# EAGLE design radical-master (EAGLE 7.2.0)
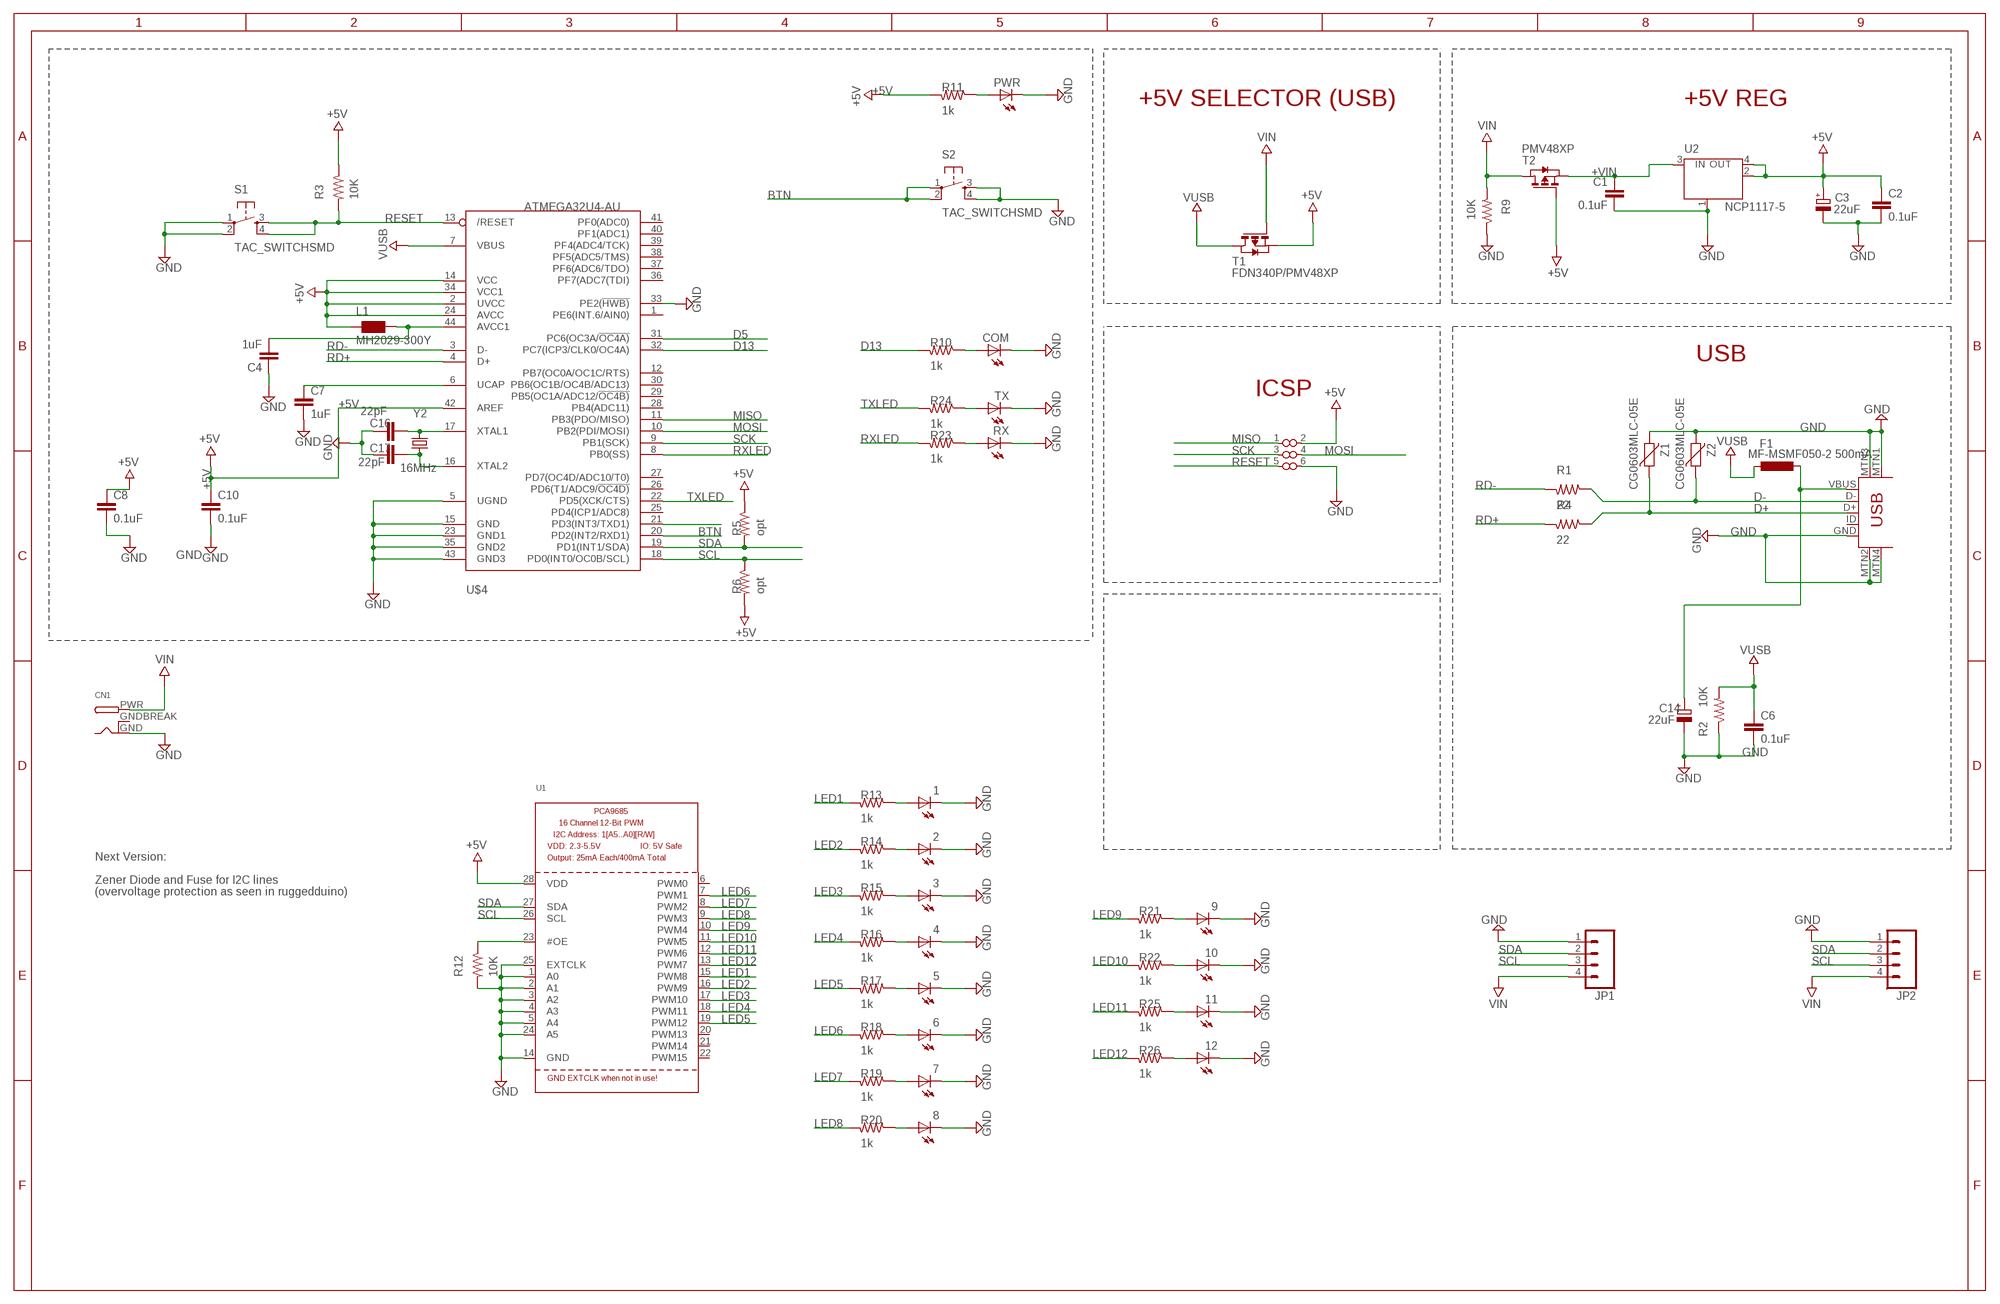
[diagram p0: schematic, sheet 1]

## Parts
1  LEDCHIPLED_0603  [CHIPLED_0603]
2  LEDCHIPLED_0603  [CHIPLED_0603]
3  LEDCHIPLED_0603  [CHIPLED_0603]
4  LEDCHIPLED_0603  [CHIPLED_0603]
5  LEDCHIPLED_0603  [CHIPLED_0603]
6  LEDCHIPLED_0603  [CHIPLED_0603]
7  LEDCHIPLED_0603  [CHIPLED_0603]
8  LEDCHIPLED_0603  [CHIPLED_0603]
9  LEDCHIPLED_0603  [CHIPLED_0603]
10  LEDCHIPLED_0603  [CHIPLED_0603]
11  LEDCHIPLED_0603  [CHIPLED_0603]
12  LEDCHIPLED_0603  [CHIPLED_0603]
C1  0.1uF  CAP0603-CAP  [0603-CAP]
C2  0.1uF  CAP0603-CAP  [0603-CAP]
C3  22uF  CPOL-EUSMCB  [SMC_B]
C4  1uF  CAP0603-CAP  [0603-CAP]
C6  0.1uF  CAP0603-CAP  [0603-CAP]
C7  1uF  CAP0603-CAP  [0603-CAP]
C8  0.1uF  CAP0603-CAP  [0603-CAP]
C10  0.1uF  CAP0603-CAP  [0603-CAP]
C14  22uF  CPOL-EUSMCB  [SMC_B]
C16  22pF  CAP0603-CAP  [0603-CAP]
C17  22pF  CAP0603-CAP  [0603-CAP]
CN1  DCBARRELPTH  [DCJACK_2MM_PTH]
COM  LEDCHIPLED_0603  [CHIPLED_0603]
F1  MF-MSMF050-2 500mA  L-EUL1812  [L1812]
JP1  M04PTH  [1X04]
JP2  M04PTH  [1X04]
L1  MH2029-300Y  WE-CBF_0805  [0805]
PWR  LEDCHIPLED_0603  [CHIPLED_0603]
R1  22  RESISTOR0805-RES  [0805]
R2  10K  RESISTOR0805-RES  [0805]
R3  10K  RESISTOR0805-RES  [0805]
R4  22  RESISTOR0805-RES  [0805]
R5  opt  RESISTOR0805-RES  [0805]
R6  opt  RESISTOR0805-RES  [0805]
R9  10K  RESISTOR0805-RES  [0805]
R10  1k  RESISTOR0805-RES  [0805]
R11  1k  RESISTOR0805-RES  [0805]
R12  10K  RESISTOR0805-RES  [0805]
R13  1k  RESISTOR0805-RES  [0805]
R14  1k  RESISTOR0805-RES  [0805]
R15  1k  RESISTOR0805-RES  [0805]
R16  1k  RESISTOR0805-RES  [0805]
R17  1k  RESISTOR0805-RES  [0805]
R18  1k  RESISTOR0805-RES  [0805]
R19  1k  RESISTOR0805-RES  [0805]
R20  1k  RESISTOR0805-RES  [0805]
R21  1k  RESISTOR0805-RES  [0805]
R22  1k  RESISTOR0805-RES  [0805]
R23  1k  RESISTOR0805-RES  [0805]
R24  1k  RESISTOR0805-RES  [0805]
R25  1k  RESISTOR0805-RES  [0805]
R26  1k  RESISTOR0805-RES  [0805]
RX  LEDCHIPLED_0603  [CHIPLED_0603]
S1  TAC_SWITCHSMD  [TACTILE-SWITCH-SMD]
S2  TAC_SWITCHSMD  [TACTILE-SWITCH-SMD]
T1  FDN340P/PMV48XP  PMOSSOT23  [SOT-23]
T2  PMV48XP  PMOSSOT23  [SOT-23]
TX  LEDCHIPLED_0603  [CHIPLED_0603]
U1  PCA9685  [TSSOP28]
U2  NCP1117-5  LINEAR_MC33269ST  [LINEAR_SOT223]
U$3  USB-MINIB-5PIN  [USB-MINIB]
U$4  ATMEGA32U4-AU  [TQFP44]
U$10  ISP_POGO  [POGO_ISP]
Y2  16MHz  CRYSTAL5X3  [CRYSTAL-SMD-5X3]
Z1  CG0603MLC-05E  VARISTORCN0603  [CT/CN0603]
Z2  CG0603MLC-05E  VARISTORCN0603  [CT/CN0603]

## Nets
+5V: C2.1 C3.+ C8.1 C10.1 L1.1 R3.1 R5.1 R6.2 R11.2 T1.2(S) T2.3(G) U1.28(VDD) U2.2(OUT) U2.4(OUT) U$4.2(UVCC) U$4.14(VCC) U$4.24(AVCC) U$4.34(VCC1) U$4.42(AREF) U$10.2(VCC)
+VIN: C1.1 T2.2(S) U2.3(IN)
BTN: S2.1 S2.2 U$4.20(PD2(INT2/RXD1))
D5: U$4.31(PC6(OC3A/!OC4A))
D13: R10.2 U$4.32(PC7(ICP3/CLK0/OC4A))
D+: R4.1 U$3.D+ Z1.1
D-: R1.1 U$3.D- Z2.1
GND: 1.C 2.C 3.C 4.C 5.C 6.C 7.C 8.C 9.C 10.C 11.C 12.C C1.2 C2.2 C3.- C4.1 C6.2 C7.2 C8.2 C10.2 C14.- C16.2 C17.2 CN1.GND COM.C JP1.1 JP2.1 PWR.C R2.1 R9.1 R12.2 RX.C S1.1 S1.2 S2.3 S2.4 TX.C U1.1(A0) U1.2(A1) U1.3(A2) U1.4(A3) U1.5(A4) U1.14(GND) U1.24(A5) U1.25(EXTCLK) U2.1(GND/ADJ) U$3.GND U$3.MTN1(MTN2) U$3.MTN2(MTN3) U$3.MTN3(MTN1) U$3.MTN4 U$4.5(UGND) U$4.15(GND) U$4.23(GND1) U$4.33(PE2(!HWB)) U$4.35(GND2) U$4.43(GND3) U$10.6(GND) Z1.2 Z2.2
LED1: R13.2 U1.15(PWM8)
LED2: R14.2 U1.16(PWM9)
LED3: R15.2 U1.17(PWM10)
LED4: R16.2 U1.18(PWM11)
LED5: R17.2 U1.19(PWM12)
LED6: R18.2 U1.7(PWM1)
LED7: R19.2 U1.8(PWM2)
LED8: R20.2 U1.9(PWM3)
LED9: R21.2 U1.10(PWM4)
LED10: R22.2 U1.11(PWM5)
LED11: R25.2 U1.12(PWM6)
LED12: R26.2 U1.13(PWM7)
MISO: U$4.11(PB3(PDO/MISO)) U$10.1(MISO)
MOSI: U$4.10(PB2(PDI/MOSI)) U$10.4(MOSI)
N$1: C16.1 U$4.17(XTAL1) Y2.3
N$2: U$4.21(PD3(INT3/TXD1))
N$3: C17.1 U$4.16(XTAL2) Y2.1
N$5: C7.1 U$4.6(UCAP)
N$6: C4.2 L1.2 U$4.44(AVCC1)
N$7: R23.1 RX.A
N$8: R24.1 TX.A
N$9: COM.A R10.1
N$10: PWR.A R11.1
N$12: R12.1 U1.23(#OE)
N$14: 1.A R13.1
N$15: 2.A R14.1
N$16: 3.A R15.1
N$17: 4.A R16.1
N$18: 5.A R17.1
N$19: 6.A R18.1
N$20: 7.A R19.1
N$21: 8.A R20.1
N$22: 9.A R21.1
N$23: 10.A R22.1
N$24: 11.A R25.1
N$25: 12.A R26.1
RD+: R4.2 U$4.4(D+)
RD-: R1.2 U$4.3(D-)
RESET: R3.2 S1.3 S1.4 U$4.13(/RESET) U$10.5(RESET)
RXLED: R23.2 U$4.8(PB0(SS))
SCK: U$4.9(PB1(SCK)) U$10.3(SCK)
SCL: JP1.3 JP2.3 R6.1 U1.26(SCL) U$4.18(PD0(INT0/OC0B/SCL))
SDA: JP1.2 JP2.2 R5.2 U1.27(SDA) U$4.19(PD1(INT1/SDA))
TXLED: R24.2 U$4.22(PD5(XCK/CTS))
VIN: CN1.PWR JP1.4 JP2.4 R9.2 T1.3(G) T2.1(D)
VUSB: C6.1 F1.2 R2.2 T1.1(D) U$4.7(VBUS)
VUSBD: C14.+ F1.1 U$3.VBUS
Unconnected: U1.6(PWM0) U1.20(PWM13) U1.21(PWM14) U1.22(PWM15) U$3.ID U$4.1(PE6(INT.6/AIN0)) U$4.12(PB7(OC0A/OC1C/RTS)) U$4.25(PD4(ICP1/ADC8)) U$4.26(PD6(T1/ADC9/!OC4D)) U$4.27(PD7(OC4D/ADC10/T0)) U$4.28(PB4(ADC11)) U$4.29(PB5(OC1A/ADC12/!OC4B)) U$4.30(PB6(OC1B/OC4B/ADC13)) U$4.36(PF7(ADC7(TDI)) U$4.37(PF6(ADC6/TDO)) U$4.38(PF5(ADC5/TMS)) U$4.39(PF4(ADC4/TCK)) U$4.40(PF1(ADC1)) U$4.41(PF0(ADC0))

## Notes on the sheet
- +5V SELECTOR (USB) | +5V REG
- USB
- ICSP
- Next Version:
- Zener Diode and Fuse for I2C lines
- (overvoltage protection as seen in ruggedduino)

## Power pins joined to a net without a drawn wire
GNDBREAK: CN1.GNDBREAK

## Library data of the parts
1-12 COM PWR RX TX = adafruit:LED: LED OSRAM: - CHIPLED LG R971, LG N971, LY N971, LG Q971, LY Q971, LO R971, LY R971 LH N974, LH R974 LS Q976, LO Q976, LY Q976 LO Q996 - Hyper CHIPLED LW Q18S LB Q993, LB Q99A, LB R99A - SideLED LS A670, LO A670, LY A670, LG A670, LP A670 LB A673, LV A673, LT A673, LW A673 LH A674 LY A675 LS A676, LA A676, LO A676, LY A676, LW A676 LS A679, LY A679, LG A679 - Hyper Micro SIDELED® LS Y876, LA Y876, LO Y876, LY Y876 LT Y87S - SmartLED LW L88C, LW L88S LB L89C, LB L89S, LG L890 LS L89K, LO L89K, LY L89K LS L896, LA L896, LO L896, LY L896 - TOPLED LS T670, LO T670, LY T670, LG T670, LP T670 LSG T670, LSP T670, LSY T670, LOP T670, LYG T670 LG T671, LOG T671, LSG T671 LB T673, LV T673, LT T673, LW T673 LH T674 LS T676, LA T676, LO T676, LY T676, LB T676, LH T676, LSB T676, LW T676 LB T67C, LV T67C, LT T67C, LS T67K, LO T67K, LY T67K, LW E67C LS E67B, LA E67B, LO E67B, LY E67B, LB E67C, LV E67C, LT E67C LW T67C LS T679, LY T679, LG T679 LS T770, LO T770, LY T770, LG T770, LP T770 LB T773, LV T773, LT T773, LW T773 LH T774 LS E675, LA E675, LY E675, LS T675 LS T776, LA T776, LO T776, LY T776, LB T776 LHGB T686 LT T68C, LB T68C - Hyper Mini TOPLED® LB M676 - Mini TOPLED Santana® LG M470 LS M47K, LO M47K, LY M47K Source: http://www.osram.convergy.de/
C1 C2 C4 C6-C8 C10 = SparkFun-Capacitors:CAP: Capacitor Standard 0603 ceramic capacitor, and 0.1" leaded capacitor.
C3 C14 = rcl:CPOL-EU: POLARIZED CAPACITOR, European symbol
C16 C17 = SparkFun:CAP: Capacitor Standard 0603 ceramic capacitor, and 0.1" leaded capacitor.
CN1 = adafruit:DCBARREL: 2.0mm DC Barrel Jack DCJACK_2MM_PTH - Through Hole Jack (4UConnector: 05537)
F1 = rcl:L-EU: INDUCTOR, European symbol
JP1 JP2 = SparkFun-Connectors:M04: Header 4 Standard 4-pin 0.1" header. Use with straight break away headers (SKU : PRT-00116), right angle break away headers (PRT-00553), swiss pins (PRT-00743), machine pins (PRT-00117), and female headers (PRT-00115). Molex polarized connector foot print use with SKU : PRT-08231 with associated crimp pins and housings. 1MM SMD Version SKU: PRT-10208
L1 = wuerth-elektronik:WE-CBF: SMD EMI Suppression Ferrite Beads - excellent anti-EMI properties - low DCR - impedances till 3000 ohms - rated current up to 6 A
R1-R6 R9-R26 = SparkFun-Resistors:RESISTOR: Resistor Basic schematic elements and footprints for 0603, 1206, and PTH resistors.
S1 S2 = SparkFun-Electromechanical:TAC_SWITCH: Momentary Switch Button commonly used for reset or general input. Spark Fun Electronics SKU : COM-00097 SMT- SWCH-08247; PROD_ID: SWCH-08247
T1 T2 = zetex:PMOSSOT23: MOS FET
U1 = adafruit:PCA9685: PCA9685 - 16 Channel 12-Bit I2C PWM Controller 5.0V tolerant 16 channel, 12-bit I2C PWM controller with 25mA per output (max. 400mA total) Digikey: 568-5931-1-ND
U2 = SmartPrj:LINEAR_MC33269ST*: Adjustable Output Low Dropout Voltage Regulator 800 mA Source: http://www.onsemi.com/pub/Collateral/MC33269-D.PDF
U$3 = SparkFun-Connectors:USB-MINIB: Mini-USB "B" connector with 5th pin broken out. Created new symbol breaking out 5th "ID" pin in mini/micro USB connector spec. See: http://en.wikipedia.org/wiki/Mini_usb#Cables. Uses same footprint as 4-pin symbol. Also added pins to connect to mounting / shield pads if required (probably not generally needed as signals aren't shielded once they leave the connector).
U$4 = adafruit:ATMEGA32U4: http://www.ladyada.net/library/eagle
U$10 = digikey:ISP_POGO
Y2 = SparkFun:CRYSTAL: Crystals Various standard crystals. Proven footprints. Spark Fun Electronics SKU : COM-00534
Z1 Z2 = varistor:VARISTOR: VARISTOR

## Board
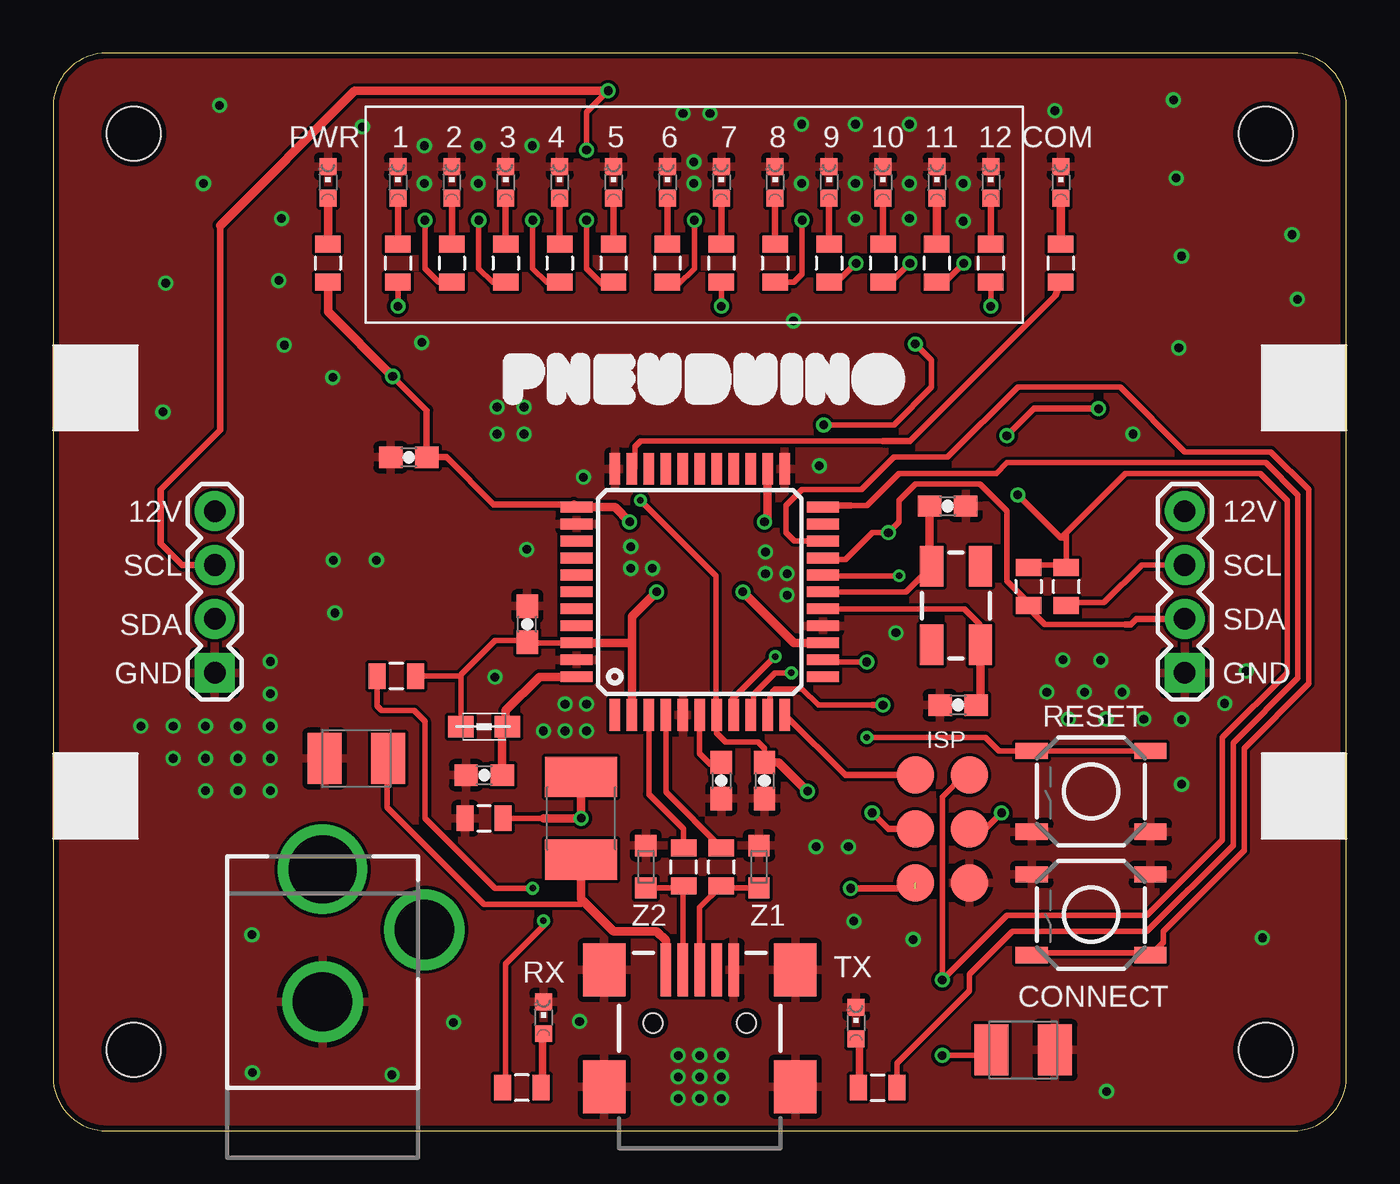
[diagram p1: board, top side]
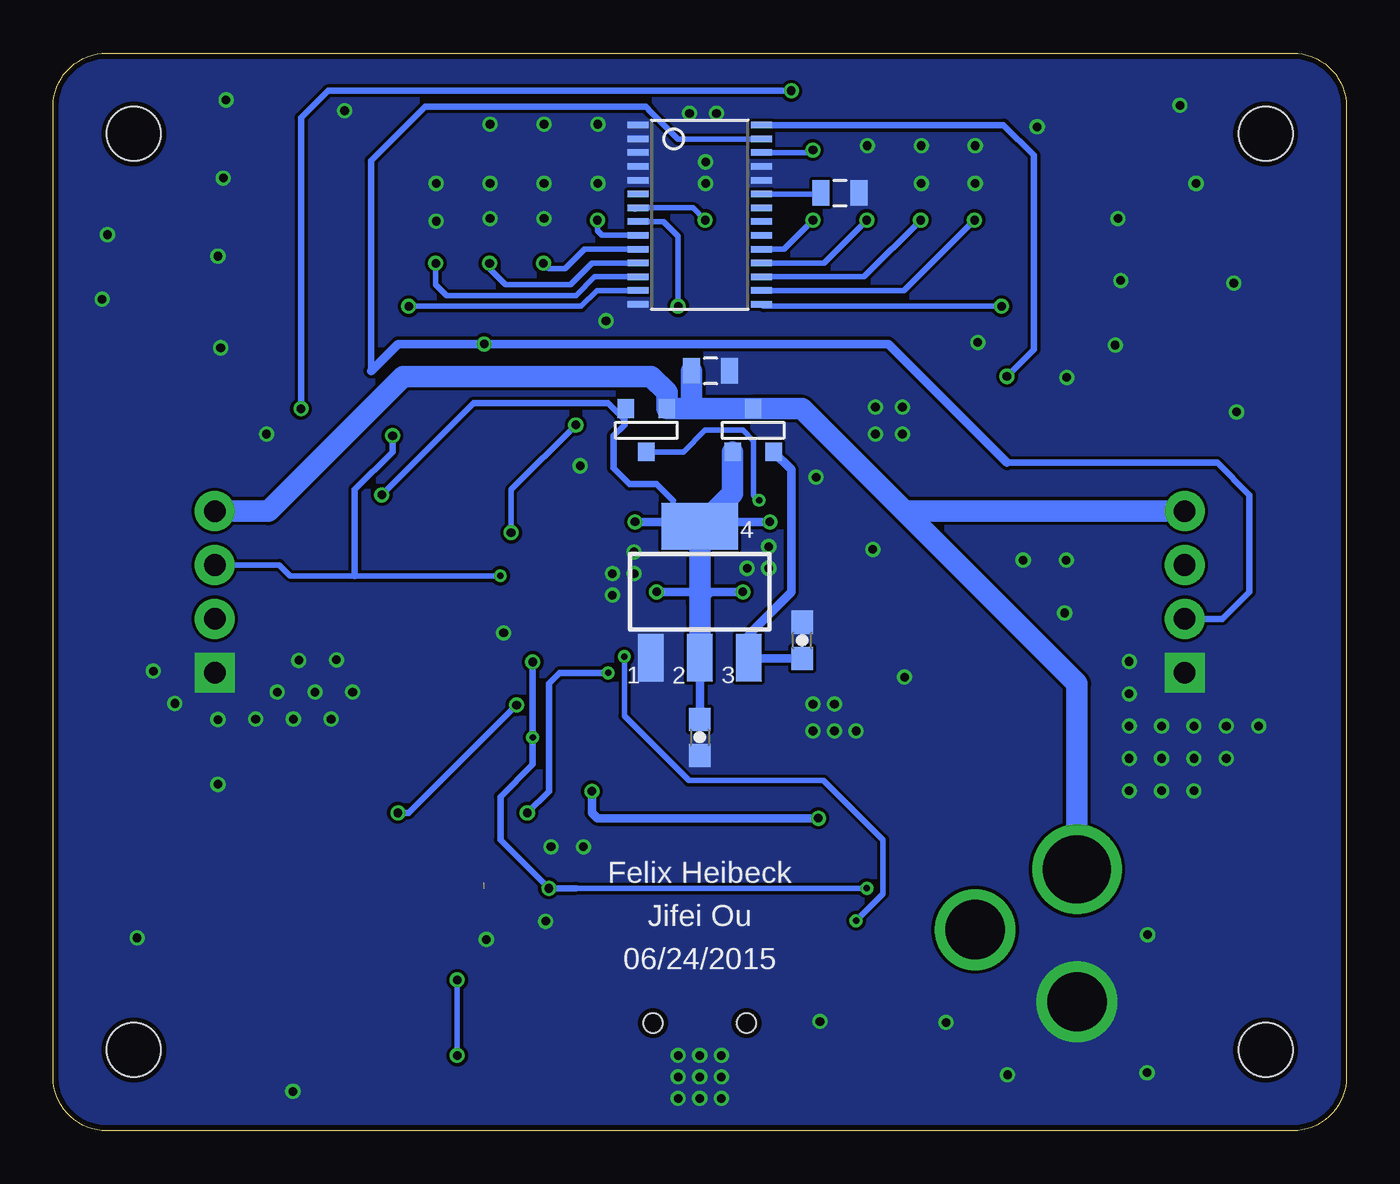
[diagram p2: board, bottom side, seen from below]

Size 60.96 x 50.8 mm. Coordinates in mm from the lower left corner, seen from the top.
Outline: 2.54,0 58.42,0 arc90 60.96,2.54 60.96,48.26 arc90 58.42,50.8 2.54,50.8 arc90 0,48.26 0,2.54 arc90 2.54,0
Copper layers (1*16): Top 0.035mm / dielectric 1.5mm / Bottom 0.035mm
Design rules "SeeedStudio_2layer_DRU_no_angle_20140221": minimum track width 6mil, minimum drill 12mil, track to track 6mil, track to pad 6mil, pad to pad 6mil, via to via 6mil, smd to smd 0mil, copper to edge 10mil, drill to drill 10mil, minimum pad ring 10mil, minimum via ring 6mil, stop-mask expansion 2mil, vias tented up to drill 100mil, thermal gap 10mil
Holes 2.54 mm at 3.81,46.99 57.15,46.99 57.15,3.81 3.81,3.81

### Footprints (pad centres in the part's own frame; a part is rotated, then mirrored left to right if it is on the bottom)
CHIPLED_0603 = smd 0.8 x 0.8: A 0,-0.75; C 0,0.75
0603-CAP = smd 1.1 x 1: 1 -0.85,0; 2 0.85,0
SMC_B = smd 1.6 x 2.4: + -1.5,0; - 1.5,0
DCJACK_2MM_PTH = drill 2.8: GND 0,7.35; GNDBREAK 4.8,10.75 | drill 3.2: PWR 0,13.6
L1812 = smd 1.9 x 3.4: 1 -1.95,0; 2 1.95,0
1X04 = drill 1.016 pad 1.88 square: 1 0,0 | drill 1.016 pad 1.88: 2 2.54,0; 3 5.08,0; 4 7.62,0
0805 = smd 1.2 x 1: 1 -1.1,0; 2 1.1,0
0805' = smd 0.8 x 1.2: 1 -0.9,0; 2 0.9,0
TACTILE-SWITCH-SMD = smd 1.524 x 0.762: 1 -2.794,1.905; 2 2.794,1.905; 3 -2.794,-1.905; 4 2.794,-1.905
SOT-23 = smd 0.787 x 0.889: 1 0.025,-1.016; 2 -0.94,1.016; 3 0.991,1.016
TSSOP28 = smd 0.305 x 0.991: 1 -4.225,-2.918; 2 -3.575,-2.918; 3 -2.925,-2.918; 4 -2.275,-2.918; 5 -1.625,-2.918; 6 -0.975,-2.918; 7 -0.325,-2.918; 8 0.325,-2.918; 9 0.975,-2.918; 10 1.625,-2.918; 11 2.275,-2.918; 12 2.925,-2.918; 13 3.575,-2.918; 14 4.225,-2.918; 15 4.225,2.918; 16 3.575,2.918; 17 2.925,2.918; 18 2.275,2.918; 19 1.625,2.918; 20 0.975,2.918; 21 0.325,2.918; 22 -0.325,2.918; 23 -0.975,2.918; 24 -1.625,2.918; 25 -2.275,2.918; 26 -2.925,2.918; 27 -3.575,2.918; 28 -4.225,2.918
LINEAR_SOT223 = smd 1.219 x 2.235: 1 -2.311,-3.099; 2 0,-3.099; 3 2.311,-3.099 | smd 3.6 x 2.2: 4 0,3.099
USB-MINIB = smd 2.5 x 0.5: D+ 2.5,0; D- 2.5,0.8; GND 2.5,-1.6; ID 2.5,-0.8; VBUS 2.5,1.6 | smd 2.5 x 2: MTN1 -3,4.5; MTN2 2.5,4.5; MTN3 -3,-4.5; MTN4 2.5,-4.5 | hole 0.9: 0,2.2; 0,-2.2
TQFP44 = smd 1.5 x 0.5: 1 -5.8,4; 2 -5.8,3.2; 3 -5.8,2.4; 4 -5.8,1.6; 5 -5.8,0.8; 6 -5.8,0; 7 -5.8,-0.8; 8 -5.8,-1.6; 9 -5.8,-2.4; 10 -5.8,-3.2; 11 -5.8,-4; 23 5.8,-4; 24 5.8,-3.2; 25 5.8,-2.4; 26 5.8,-1.6; 27 5.8,-0.8; 28 5.8,0; 29 5.8,0.8; 30 5.8,1.6; 31 5.8,2.4; 32 5.8,3.2; 33 5.8,4 | smd 0.5 x 1.5: 12 -4,-5.8; 13 -3.2,-5.8; 14 -2.4,-5.8; 15 -1.6,-5.8; 16 -0.8,-5.8; 17 0,-5.8; 18 0.8,-5.8; 19 1.6,-5.8; 20 2.4,-5.8; 21 3.2,-5.8; 22 4,-5.8; 34 4,5.8; 35 3.2,5.8; 36 2.4,5.8; 37 1.6,5.8; 38 0.8,5.8; 39 0,5.8; 40 -0.8,5.8; 41 -1.6,5.8; 42 -2.4,5.8; 43 -3.2,5.8; 44 -4,5.8
POGO_ISP = smd 1.778 x 1.778: 1 -1.27,2.54; 2 1.27,2.54; 3 -1.27,0; 4 1.27,0; 5 -1.27,-2.54; 6 1.27,-2.54
CRYSTAL-SMD-5X3 = smd 1.9 x 1.1: 1 -1.85,-1.15; 2 1.85,-1.15; 3 1.85,1.15; 4 -1.85,1.15
CT/CN0603 = smd 1 x 1: 1 -1,0; 2 1,0

### Placement (x,y rotation side)
1  16.26,44.7 0 top
2  18.8,44.7 0 top
3  21.34,44.7 0 top
4  23.88,44.7 0 top
5  26.42,44.7 0 top
6  28.96,44.7 0 top
7  31.5,44.7 0 top
8  34.04,44.7 0 top
9  36.58,44.7 0 top
10  39.12,44.7 0 top
11  41.66,44.7 0 top
12  44.2,44.7 0 top
C1  25.65,23.11 90 bottom
C2  16.76,31.75 180 top
C3  45.72,3.81 0 top
C4  20.32,16.76 0 top
C6  33.53,16.51 270 top
C7  31.5,16.51 270 top
C8  30.48,18.54 270 bottom
C10  22.35,23.88 90 top
C14  14.3,17.55 180 top
C16  42.16,29.45 0 top
C17  42.65,20.07 180 top
CN1  12.7,-1.27 0 top
COM  47.5,44.7 0 top
F1  24.89,14.73 90 top
JP1  53.34,21.59 90 top
JP2  7.62,21.59 90 top
L1  20.32,19.05 0 top
PWR  12.95,44.7 0 top
R1  22  [0805']  29.72,12.45 90 top
R2  10K  [0805']  20.32,14.73 0 top
R3  10K  [0805']  16.18,21.44 180 top
R4  22  [0805']  31.5,12.45 90 top
R5  opt  [0805']  45.97,25.65 270 top
R6  opt  [0805']  47.75,25.65 90 top
R9  10K  [0805']  29.97,35.81 180 bottom
R10  1k  [0805']  47.5,40.89 270 top
R11  1k  [0805']  12.95,40.89 270 top
R12  10K  [0805']  23.88,44.2 0 bottom
R13  1k  [0805']  16.26,40.89 270 top
R14  1k  [0805']  18.8,40.89 270 top
R15  1k  [0805']  21.34,40.89 270 top
R16  1k  [0805']  23.88,40.89 270 top
R17  1k  [0805']  26.42,40.89 270 top
R18  1k  [0805']  28.96,40.89 270 top
R19  1k  [0805']  31.5,40.89 270 top
R20  1k  [0805']  34.04,40.89 270 top
R21  1k  [0805']  36.58,40.89 270 top
R22  1k  [0805']  39.12,40.89 270 top
R23  1k  [0805']  22.1,2.03 180 top
R24  1k  [0805']  38.86,2.03 0 top
R25  1k  [0805']  41.66,40.89 270 top
R26  1k  [0805']  44.2,40.89 270 top
RX  23.11,5.33 0 top
S1  48.92,16 180 top
S2  48.92,10.19 180 top
T1  33.02,33.02 0 bottom
T2  27.94,33.02 180 bottom
TX  37.85,5.08 0 top
U1  30.48,43.18 270 bottom
U2  30.48,25.4 0 bottom
U$3  30.48,5.08 90 top
U$4  30.48,25.4 90 top
U$10  41.91,14.22 0 top
Y2  42.55,24.76 90 top
Z1  33.27,12.45 90 top
Z2  27.94,12.45 90 top

### Tracks (layer width: path | path; a pad name or v marks a point on that pad's centre or on a via)
+5V  (via drill 0.41)
  Top 0.254: U$4.42 22.38,23 C10.1 22.26,23.11 20.83,23.11 19.22,21.51 19.22,21.34 | 19.05,19.05 L1.1 19.22,21.34 | 47.75,26.67 45.97,26.67 R5.1 | 47.75,26.67 47.75,27.94 | 47.75,27.94 47.75,28.19 | 47.75,26.67 R6.2 | v41.91,3.56 43.97,3.56 C3.+ | 47.75,27.94 47.5,27.94 | 47.5,27.94 v45.47,29.97 | R3.1 19.12,21.44 19.22,21.34 | U$10.2 42.93,16.76 41.91,15.75 v41.91,7.11 44.96,10.16 51.56,10.16 55.12,13.72 55.12,18.54 58.17,21.59 58.17,29.72 56.9,30.99 50.55,30.99 47.5,27.94
  Top 0.305: v16,35.56 17.61,33.95 C2.1 18.54,31.75 20.76,29.53 24.55,29.53
  Top 0.406: U$4.24 33.68,28.85 v33.53,28.7 | U$4.2 27.28,23.11 | 27.28,23.11 27.28,24.23 v28.45,25.4 | U$4.42 27.17,23 27.28,23.11 | U$4.14 34.91,23 v32.51,25.4 | v27.18,28.7 26.48,29.4 U$4.34 24.55,29.53 | R11.2 12.95,38.61 v16,35.56
  Bottom 0.254: 34.04,33.53 34.04,34.04 T1.2 | 31.75,29.72 31.75,28.7 U2.4 | v41.91,7.11 v41.91,3.56
  Bottom 0.305: U1.28 16.16,47.41 14.73,45.97 14.73,36.83 v16,35.56 | 31.75,29.72 32.51,30.48 33.78,30.48 34.54,31.24 34.54,32.77 34.04,33.27 34.04,33.53 34.8,34.29 41.15,34.29 v45.47,29.97
  Bottom 0.406: v33.53,28.7 31.75,28.7 30.68,28.7 U2.4 | U2.2 C8.1 | v28.45,25.4 29.97,25.4 30.48,24.89 | v32.51,25.4 30.48,25.4 | v27.18,28.7 29.97,28.7 30.12,28.86
  Bottom 1.016: U2.2 30.48,24.89 30.48,25.4 U2.4 30.12,28.86 28.93,30.05 T2.3
+VIN
  Bottom 0.406: C1.1 28.13,22.26 U2.3 28.17,23.39 26.16,25.4 26.16,31.17 T2.2
BTN
  Top 0.254: S2.2 46.74,8.38 52.32,8.38 S2.1 52.32,8.89 52.32,9.4 56.13,13.21 56.13,18.03 59.18,21.08 59.18,30.23 57.4,32 53.34,32 50.29,35.05 45.47,35.05 42.16,31.75 39.62,31.75 38.1,30.23 35.31,30.23 34.54,29.46 34.54,28.19 34.94,27.8 U$4.20
D13
  Top 0.254: 39.12,32.51 27.69,32.51 27.43,32.26 27.43,31.24 U$4.32 | 47.24,39.88 R10.2
  Top 0.305: 39.12,32.51 40.39,32.51 47.24,39.37 R10.2
D+
  Top 0.254: Z1.1 31.6,11.45 R4.1 30.48,10.53 U$3.D+
D-
  Top 0.254: Z2.1 29.62,11.45 R1.1 29.68,11.51 U$3.D-
GND  (via drill 0.41)
  other vias: 30.48,1.52 15.98,2.64 24.82,5.16 37.49,13.39 40.54,9.02 37.74,9.88 24.13,20.12 22.33,27.41 53.19,19.38 57,9.09 49.66,1.85 20.93,32.84 9.37,9.25 9.4,2.74 22.2,32.84 34.9,38.18 18.87,5.11 50.9,32.84 35.28,44.65 37.82,43 40.36,43 42.9,44.65 20.04,44.65 17.5,44.65 30.2,44.65 7.09,44.65 47.22,48.08 52.93,44.91 10.9,37.03 13.21,26.9 53.06,36.91 10.77,43 49.63,19.41 49.38,22.17 24.99,30.81 17.37,37.16 13.28,24.41 58.39,42.24 58.65,39.19 52.81,48.59 5.31,39.95 7.85,48.34 30.2,45.67 22.58,46.43 20.04,46.43 17.5,46.43 37.82,44.65 35.28,47.45 37.82,47.45 40.36,47.45 42.9,42.88 40.36,44.65 30.96,47.96 29.69,47.96 10.64,40.08 13.18,35.51 14.58,47.32 34.59,25.25 33.58,27.28 34.59,26.26 33.58,26.26 27.23,27.53 27.23,26.52 28.24,26.52 25.15,20.12 23.11,18.85 24.13,18.85 25.15,18.85 20.83,21.39 35.97,13.39 39.73,23.47 5.18,33.88 30.48,2.54 30.48,3.56 29.46,2.54 29.46,3.56 29.46,1.52 31.5,1.52 31.5,2.54 31.5,3.56 53.19,41.22 22.2,34.11 20.93,34.11 10.24,19.08 10.24,17.55 5.66,17.55 8.71,19.08 8.71,17.55 7.19,17.55 10.24,16.03 15.24,26.9 7.19,19.08 5.66,19.08 4.14,19.08 47.85,19.41 47.6,22.2 46.84,20.68 51.41,19.41 50.39,20.68 48.62,20.68 36.12,31.34 56.24,21.67 55.22,20.14 53.19,16.33 8.71,16.03 7.19,16.03 10.24,20.6 10.24,22.12
  pour Bottom (no thermals): -1.78,52.07 63.25,52.32 63.5,-2.79 -1.52,-3.05
  pour Top: -3.3,53.09 62.23,52.83 62.23,-2.54 -3.3,-2.29
LED1  (via drill 0.41)
  Top 0.254: R13.2 v16.26,38.86
  Bottom 0.254: v16.26,38.86 27.47,38.86 U1.15
LED2  (via drill 0.41)
  Top 0.254: R14.2 18.17,39.99 17.53,40.64 v17.53,42.93
  Bottom 0.254: U1.16 20.85,39.6 v17.53,42.93
LED3  (via drill 0.41)
  Top 0.254: v20.07,42.93 20.07,40.64 20.71,39.99 R15.2
  Bottom 0.254: U1.17 22.74,40.26 v20.07,42.93
LED4  (via drill 0.41)
  Top 0.254: R16.2 23.25,39.99 22.61,40.64 v22.61,42.93
  Bottom 0.254: U1.18 24.63,40.91 v22.61,42.93
LED5  (via drill 0.41)
  Top 0.254: v25.15,42.93 25.15,40.64 25.91,39.88 26.3,39.88 R17.2
  Bottom 0.254: U1.19 26.52,41.55 v25.15,42.93
LED6  (via drill 0.41)
  Top 0.254: v30.23,42.93 30.23,40.64 29.46,39.88 29.07,39.88 R18.2
  Bottom 0.254: v30.23,42.93 30.8,43.51 U1.7 33.53,43.43
LED7  (via drill 0.41)
  Top 0.254: v31.5,38.86 R19.2
  Bottom 0.254: U1.8 32.19,42.85 31.5,42.16 v31.5,38.86
LED8  (via drill 0.41)
  Top 0.254: R20.2 34.91,39.99 35.31,40.39 v35.31,42.93
  Bottom 0.254: 35.31,42.67 v35.31,42.93 35.31,42.42 35.09,42.2 U1.9
LED9  (via drill 0.41)
  Top 0.254: R21.2 36.95,39.99 v37.85,40.89
  Bottom 0.254: U1.10 35.91,41.55 36.83,40.64 37.59,40.64 v37.85,40.89
LED10  (via drill 0.41)
  Top 0.254: R22.2 39.49,39.99 v40.39,40.89
  Bottom 0.254: v40.39,40.89 40.39,40.64 39.62,39.88 36.58,39.88 35.55,40.91 U1.11
LED11  (via drill 0.41)
  Top 0.254: R25.2 42.03,39.99 v42.93,40.89
  Bottom 0.254: v42.93,40.89 42.93,39.88 42.42,39.37 36.32,39.37 35.44,40.26 U1.12
LED12  (via drill 0.41)
  Top 0.254: R26.2 v44.2,38.86
  Bottom 0.254: v44.2,38.86 36.07,38.86 35.33,39.6 U1.13
MISO
  Top 0.254: 34.54,19.56 U$4.11
  Top 0.305: 34.54,19.56 37.34,16.76 U$10.1
MOSI  (via drill 0.41)
  Top 0.254: 38.61,20.07 36.07,20.07 35.31,20.83 34.04,20.83 33.78,20.57 33.78,19.81 U$4.10
  Top 0.305: v39.12,20.07 38.61,20.07 | U$10.4 43.94,14.22 v44.7,14.99
  Bottom 0.305: v44.7,14.99 44.2,14.99 v39.12,20.07
N$1
  Top 0.254: U$4.17 40.2,25.4 Y2.3
  Top 0.406: C16.1 41.31,26.7 Y2.3
N$3
  Top 0.254: U$4.16 42.96,24.6 43.69,23.88 43.69,22.92 Y2.1
  Top 0.406: Y2.1 43.7,20.27 C17.1
N$5
  Top 0.254: U$4.6 30.48,17.78 30.99,17.27 31.41,17.27 C7.1
N$6
  Top 0.406: C4.2 21.17,18.8 L1.2 21.34,19.13 21.34,19.81 22.92,21.4 U$4.44
N$7
  Top 0.356: RX.A 23.06,4.57 23.06,2.13 R23.1
N$8
  Top 0.356: TX.A 38,4.27 38,2.13 R24.1
N$9
  Top 0.406: COM.A R10.1
N$10
  Top 0.406: PWR.A R11.1
N$12
  Bottom 0.254: U1.23 25.07,44.16 R12.1
N$14
  Top 0.305: 1.A R13.1
N$15
  Top 0.305: 2.A R14.1
N$16
  Top 0.305: 3.A R15.1
N$17
  Top 0.305: 4.A R16.1
N$18
  Top 0.305: 5.A R17.1
N$19
  Top 0.305: 6.A R18.1
N$20
  Top 0.305: 7.A R19.1
N$21
  Top 0.305: 8.A R20.1
N$22
  Top 0.305: 9.A R21.1
N$23
  Top 0.305: 10.A R22.1
N$24
  Top 0.406: 11.A R25.1
N$25
  Top 0.305: 12.A R26.1
RD+
  Top 0.254: U$4.4 28.88,15.96 R4.2
RD-
  Top 0.254: U$4.3 28.08,15.86 29.72,14.22 R1.2
RESET  (via drill 0.3, 0.41)  (1 unrouted)
  Top 0.254: 38.1,22.1 36.32,22.1 U$4.13 | R3.2 15.28,20.03 15.49,19.81 17.02,19.81 17.53,19.3 17.53,14.73 20.83,11.43 v22.61,11.43 | S1.3 S1.4 44.58,17.91 43.94,18.54 v38.35,18.54
  Top 0.305: 38.1,22.1 v38.35,22.1 | v37.59,11.43 40.64,11.43
  Bottom 0.254: 36.32,11.43 v22.61,11.43
  Bottom 0.305: 36.32,11.43 v37.59,11.43 39.88,13.72 39.88,15.75 38.35,17.27 v38.35,18.54 v38.35,22.1
RXLED  (via drill 0.3)
  Top 0.254: v34.04,22.35 32,20.32 32,19.81 U$4.8 | v23.11,9.91 23.11,9.65 21.34,7.87 21.34,2.17 R23.2
  Bottom 0.254: v23.11,9.91 21.84,11.18 21.84,13.72 24.64,16.51 30.99,16.51 34.04,19.56 v34.04,22.35
SCK  (via drill 0.3, 0.41)
  Top 0.254: v34.8,21.59 34.04,21.59 33.02,20.57 33.02,19.81 U$4.9
  Top 0.305: U$10.3 39.37,14.22 v38.61,14.99
  Bottom 0.305: v34.8,21.59 37.08,21.59 37.59,21.08 37.59,16 v38.61,14.99
SCL  (via drill 0.3, 0.41)
  Top 0.254: R6.1 47.75,24.89 49.53,24.89 51.31,26.67 JP1.3 | v39.88,26.16 36.32,26.16 U$4.18 | v25.15,46.23 25.15,48.01 v26.16,49.02
  Top 0.305: v49.28,34.04 46.23,34.04 v44.96,32.77 | 7.87,42.67 7.87,33.02 5.08,30.23 5.08,27.69 6.1,26.67 JP2.3
  Top 0.406: v26.16,49.02 14.22,49.02 7.87,42.67
  Bottom 0.254: v39.88,26.16 46.74,26.16 49.78,26.16 50.29,26.67 JP1.3 | U1.26 25.27,46.1 v25.15,46.23
  Bottom 0.305: v26.16,49.02 48.01,49.02 49.28,47.75 v49.28,34.04 | v44.96,32.77 44.96,32 46.74,30.23 46.74,26.16
SDA  (via drill 0.41)
  Top 0.254: 50.55,23.88 46.74,23.88 45.97,24.64 R5.2 45.97,24.89 44.96,25.91 44.96,29.21 43.69,30.48 40.64,30.48 39.88,29.72 39.88,28.7 v39.37,28.19 38.61,28.19 37.34,26.92 36.32,26.92 U$4.19 | v36.32,33.27 39.62,33.27 41.4,35.05 41.4,36.32 v40.64,37.08
  Top 0.305: 50.55,23.88 50.8,23.88 51.05,24.13 JP1.2
  Bottom 0.254: 32.77,48.01 31.5,46.74 27.69,46.74 U1.27 | v39.37,28.19 39.37,30.23 v36.32,33.27
  Bottom 0.305: 45.97,35.81 45.97,45.72 43.43,48.26 33.02,48.26 32.77,48.01 | 16,31.5 6.1,31.5 4.57,29.97 4.57,25.4 5.84,24.13 JP2.2
  Bottom 0.406: 16,31.5 21.59,37.08 v40.64,37.08 44.7,37.08 45.97,35.81
TXLED
  Top 0.254: 36.32,29.46 U$4.22 | 37.59,29.46 38.35,29.46 39.88,30.99 44.45,30.99 44.96,31.5 57.15,31.5 58.67,29.97 58.67,21.34 55.63,18.29 55.63,13.46 51.56,9.4 45.21,9.4 43.18,7.37 43.18,6.6 39.76,3.19 R24.2
  Top 0.305: 36.32,29.46 37.59,29.46
VIN
  Bottom 1.016: 30.73,34.04 T1.3 32.03,34.82 32.77,35.56 44.45,35.56 50.8,29.21 JP1.4 | 20.83,29.21 25.65,34.04 T2.1 30.73,34.04 | R9.2 30.87,34.17 30.73,34.04 | CN1.PWR 12.7,21.08 20.83,29.21 | JP2.4 20.83,29.21
VUSB  (via drill 0.3, 0.41)
  Top 0.254: C6.1 33.53,18.03 33.22,18.34 31.7,18.34 31.28,18.76 U$4.7 31.24,19.81 31.24,26.16 v27.69,29.72 | 23.11,14.73 R2.2
  Top 0.406: C6.1 34.2,17.36 v35.56,16 | F1.2 v24.89,14.73 23.11,14.73
  Bottom 0.254: T1.1 31.24,32 30.23,33.02 28.45,33.02 27.94,32.51 27.94,29.97 v27.69,29.72
  Bottom 0.406: v35.56,16 35.56,14.99 35.31,14.73 v24.89,14.73
VUSBD
  Top 0.254: 25.02,10.79 24.89,10.67 20.32,10.67 15.75,15.24 15.75,17.5 C14.+
  Top 0.406: U$3.VBUS 28.88,8.97 28.45,9.4 26.42,9.4 25.02,10.79 24.89,10.92 F1.1

### Text on the board
tNames: 12V | 12V | SCL | SCL | SDA | SDA | GND | GND | RESET | CONNECT
bNames: Felix Heibeck | Jifei Ou | 06/24/2015